# EAGLE design Canbus controller - 4 (EAGLE 9.6.0)
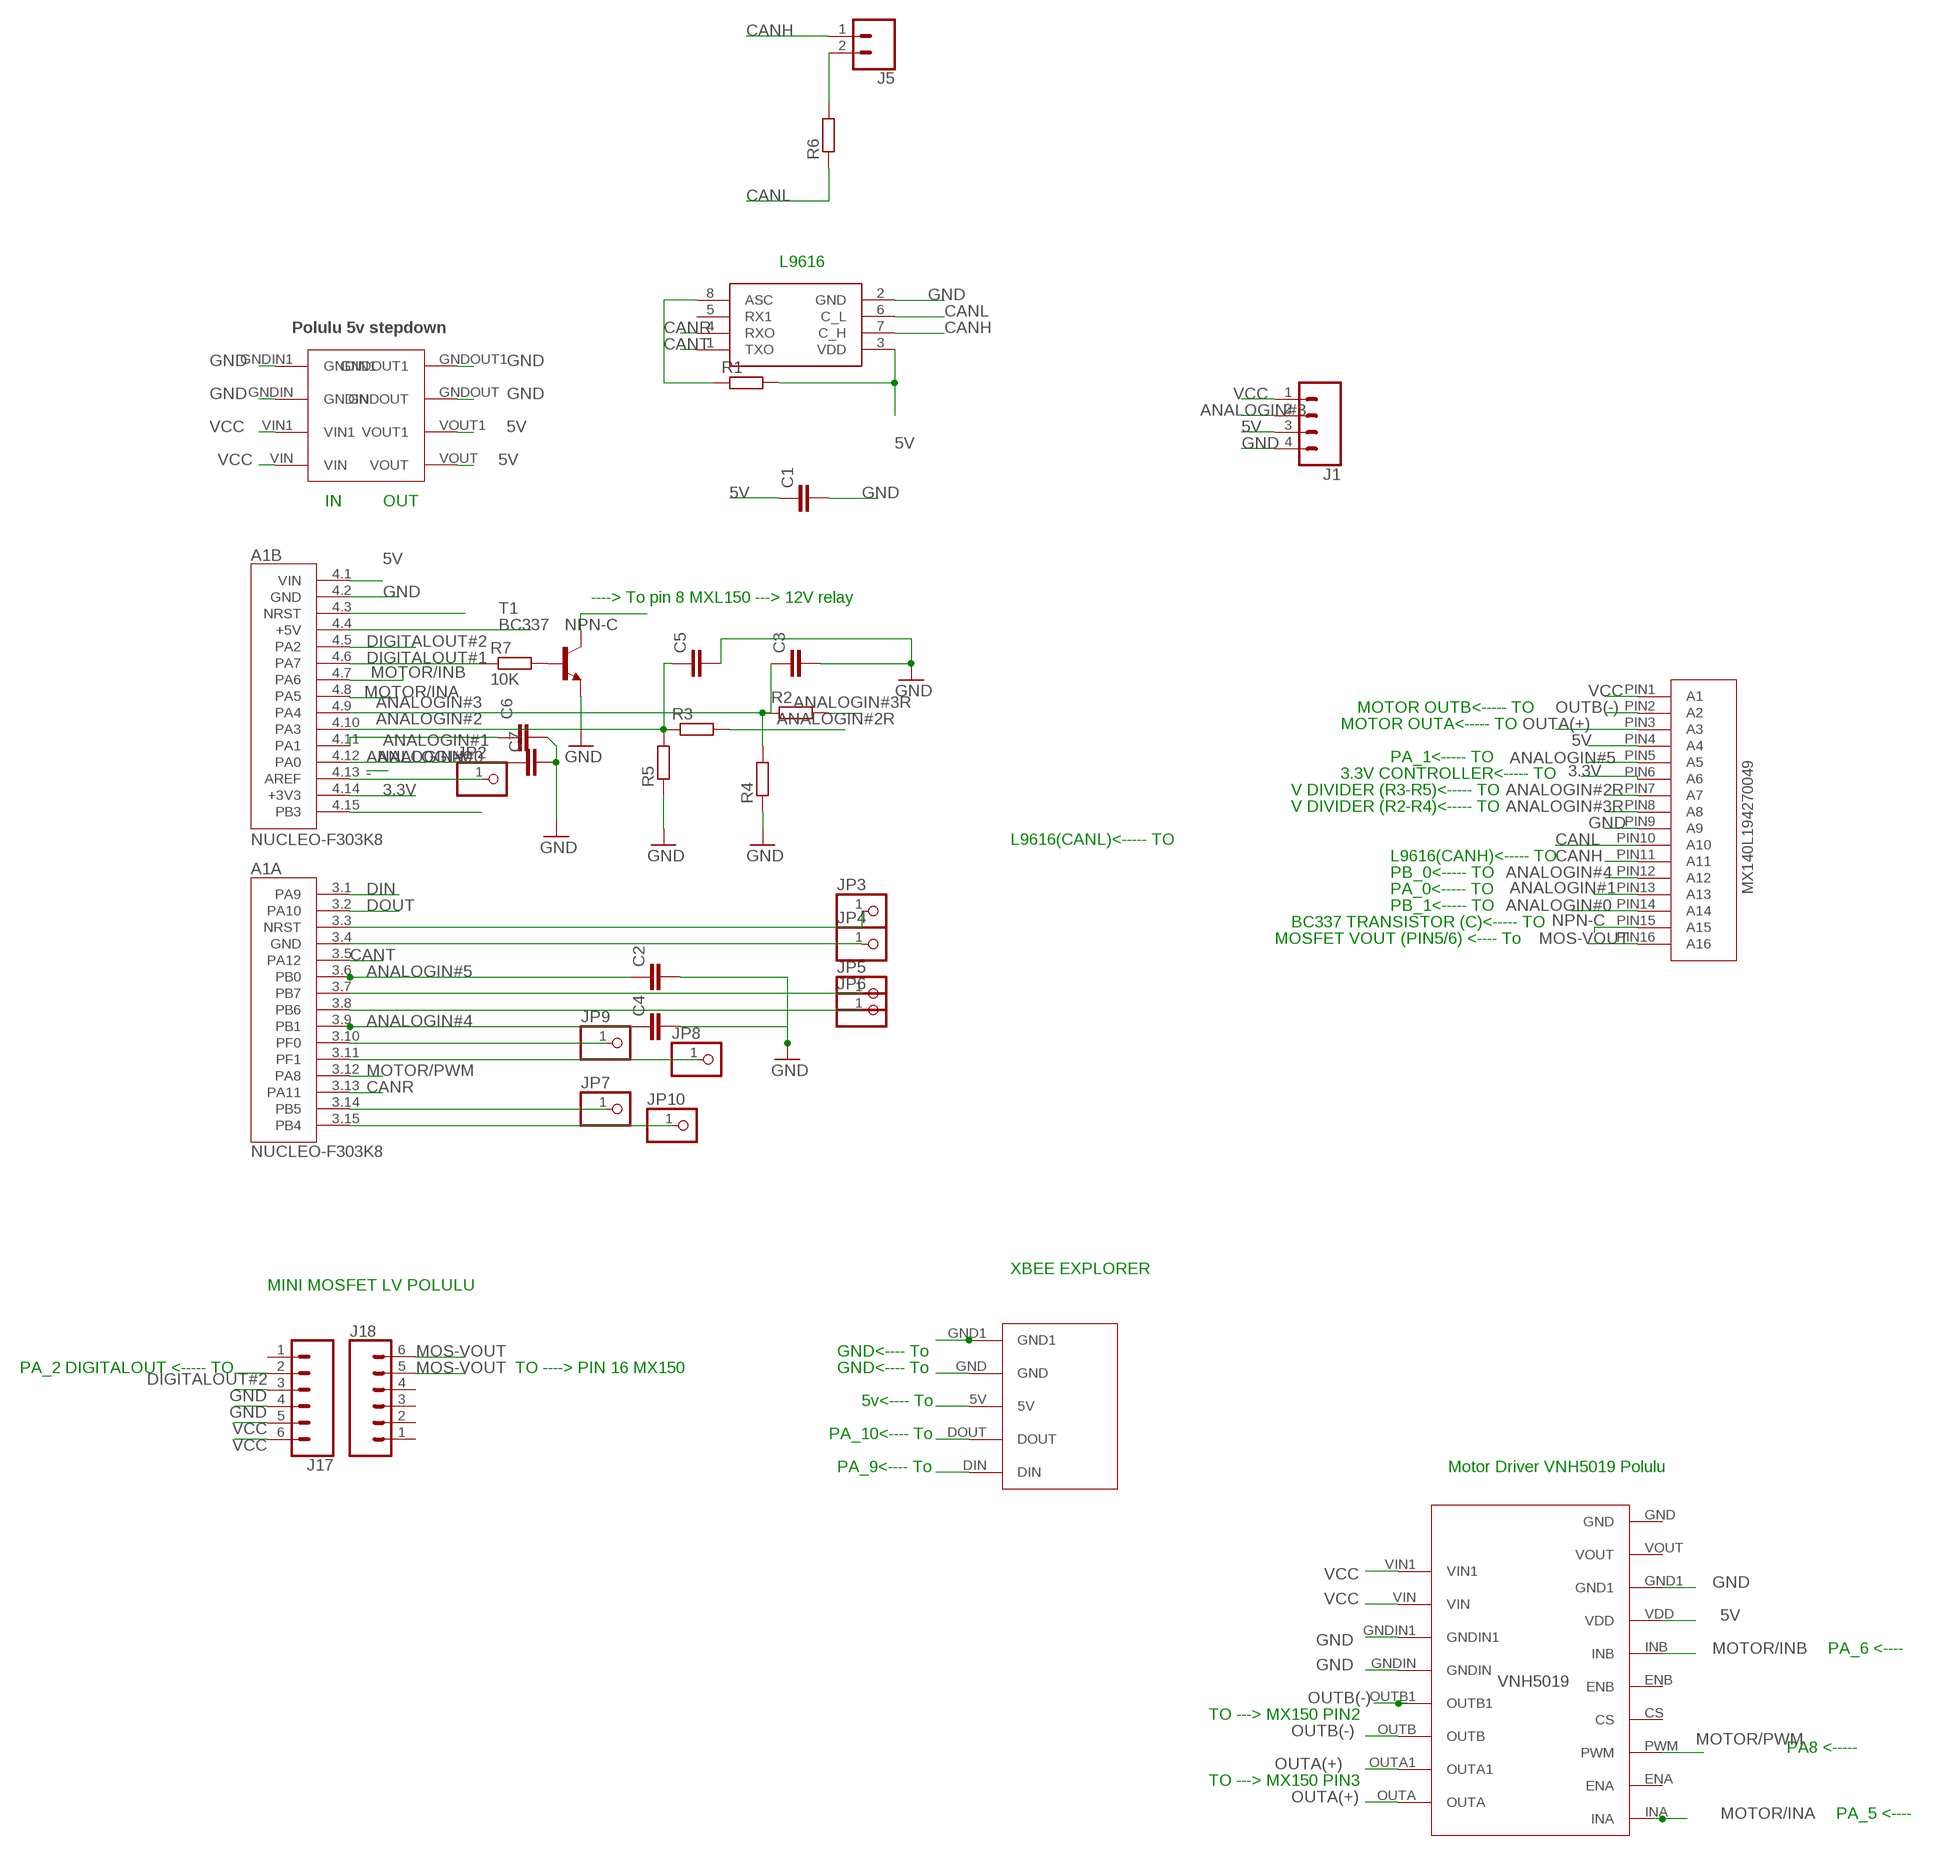
[diagram p0: schematic, sheet 1]

## Parts
A1  NUCLEO-F303K8  [MODULE_NUCLEO-F303K8]
C1  C2,5-3  [C2.5-3]
C2  C-EUC0805  [C0805]
C3  C-EUC0805  [C0805]
C4  C-EUC0805  [C0805]
C5  C-EUC0805  [C0805]
C6  C-EUC0805  [C0805]
C7  C-EUC0805  [C0805]
J1  CONN_04POLAR  [MOLEX-1X4]
J5  CONN_02  [1X02]
J17  CONN_06NO_SILK_FEMALE_PTH  [1X06_NO_SILK]
J18  CONN_06NO_SILK_FEMALE_PTH  [1X06_NO_SILK]
JP2  PINHD-1X1  [1X01]
JP3  PINHD-1X1  [1X01]
JP4  PINHD-1X1  [1X01]
JP5  PINHD-1X1  [1X01]
JP6  PINHD-1X1  [1X01]
JP7  PINHD-1X1  [1X01]
JP8  PINHD-1X1  [1X01]
JP9  PINHD-1X1  [1X01]
JP10  PINHD-1X1  [1X01]
R1  R-EU_0207/7  [0207/7]
R2  R-EU_0207/7  [0207/7]
R3  R-EU_0207/7  [0207/7]
R4  R-EU_0207/7  [0207/7]
R5  R-EU_0207/7  [0207/7]
R6  R-EU_0207/7  [0207/7]
R7  10K  R-EU_0207/7  [0207/7]
T1  BC337  [TO92]
U$1  L9616  [SO8]
U$2  MX140L-194270049  [MX150L-194270049]
U$3  XBEEEXPLORER  [XBEEREGULATED]
U$4  VNH5019  [VNH5019]
U$5  5VSTEPDOWN  [5VSTEPDOWN]

## Nets
3.3V: A1.4.14(B:+3V3) U$2.PIN6(A6)
5V: A1.4.1(B:VIN) C1.1 J1.3 R1.2 U$1.3(VDD) U$2.PIN4(A4) U$3.5V U$4.VDD U$5.VOUT U$5.VOUT1
-: A1.4.13(B:AREF) JP2.1
ANALOGIN#0: A1.4.12(B:PA0) C7.1 U$2.PIN14(A14)
ANALOGIN#1: A1.4.11(B:PA1) C6.1 U$2.PIN13(A13)
ANALOGIN#2: A1.4.10(B:PA3) C5.1 R3.1 R5.2
ANALOGIN#2R: R3.2 U$2.PIN7(A7)
ANALOGIN#3: A1.4.9(B:PA4) C3.1 J1.2 R2.1 R4.2
ANALOGIN#3R: R2.2 U$2.PIN8(A8)
ANALOGIN#4: A1.3.9(A:PB1) C4.1 U$2.PIN12(A12)
ANALOGIN#5: A1.3.6(A:PB0) C2.1 U$2.PIN5(A5)
CANH: J5.1 U$1.7(C_H) U$2.PIN11(A11)
CANL: R6.1 U$1.6(C_L) U$2.PIN10(A10)
CANR: A1.3.13(A:PA11) U$1.4(RXO)
CANT: A1.3.5(A:PA12) U$1.1(TXO)
DIGITALOUT#1: A1.4.6(B:PA7) R7.1
DIGITALOUT#2: A1.4.5(B:PA2) J17.2
DIN: A1.3.1(A:PA9) U$3.DIN
DOUT: A1.3.2(A:PA10) U$3.DOUT
GND: A1.4.2(B:GND) C1.2 C2.2 C3.2 C4.2 C5.2 C6.2 C7.2 J1.4 J17.3 J17.4 R4.1 R5.1 T1.1(E) U$1.2(GND) U$2.PIN9(A9) U$3.GND U$3.GND1 U$4.GND1 U$4.GNDIN U$4.GNDIN1 U$5.GNDIN U$5.GNDIN1 U$5.GNDOUT U$5.GNDOUT1
MOS-VOUT: J18.5 J18.6 U$2.PIN16(A16)
MOTOR/INA: A1.4.8(B:PA5) U$4.INA
MOTOR/INB: A1.4.7(B:PA6) U$4.INB
MOTOR/PWM: A1.3.12(A:PA8) U$4.PWM
N$1: A1.3.3(A:NRST) JP3.1
N$2: R7.2 T1.2(B)
N$3: J5.2 R6.2
N$4: R1.1 U$1.8(ASC)
N$6: A1.3.4(A:GND) JP4.1
N$7: A1.3.7(A:PB7) JP5.1
N$8: A1.3.8(A:PB6) JP6.1
N$9: A1.3.10(A:PF0) JP9.1
N$10: A1.3.11(A:PF1) JP8.1
N$11: A1.3.14(A:PB5) JP7.1
N$12: A1.3.15(A:PB4) JP10.1
N$13: A1.4.15(B:PB3)
N$15: A1.4.3(B:NRST)
N$16: A1.4.4(B:+5V)
NPN-C: T1.3(C) U$2.PIN15(A15)
OUTA(+): U$2.PIN3(A3) U$4.OUTA U$4.OUTA1
OUTB(-): U$2.PIN2(A2) U$4.OUTB U$4.OUTB1
VCC: J1.1 J17.5 J17.6 U$2.PIN1(A1) U$4.VIN U$4.VIN1 U$5.VIN U$5.VIN1
Unconnected: J17.1 J18.1 J18.2 J18.3 J18.4 U$1.5(RX1) U$4.CS U$4.ENA U$4.ENB U$4.GND U$4.VOUT

## Notes on the sheet
- L9616
- IN | OUT
- ----> To pin 8 MXL150 ---> 12V relay
- MOTOR OUTB<----- TO
- MOTOR OUTA<----- TO
- PA_1<----- TO
- 3.3V CONTROLLER<----- TO
- V DIVIDER (R3-R5)<----- TO
- V DIVIDER (R2-R4)<----- TO
- L9616(CANL)<----- TO
- L9616(CANH)<----- TO
- PB_0<----- TO
- PA_0<----- TO
- PB_1<----- TO
- BC337 TRANSISTOR (C)<----- TO
- MOSFET VOUT (PIN5/6) <---- To
- XBEE EXPLORER
- MINI MOSFET LV POLULU
- GND<---- To
- PA_2 DIGITALOUT <----- TO | TO ----> PIN 16 MX150 | GND<---- To
- 5v<---- To
- PA_10<---- To
- PA_9<---- To | Motor Driver VNH5019 Polulu
- PA_6 <----
- TO ---> MX150 PIN2
- PA8 <-----
- TO ---> MX150 PIN3
- PA_5 <----

## Library data of the parts
A1 = NUCLEO-F303K8:NUCLEO-F303K8: STM32 Nucleo-32 development board with STM32F303K8T6 MCU, supports Arduino connectivity; AVAILABILITY: Unavailable; DESCRIPTION: STM32F303K8, mbed-Enabled Development Nucleo-32 STM32F3 ARM® Cortex®-M4 MCU 32-Bit Embedded Evaluation Board; MF: STMicroelectronics; MP: NUCLEO-F303K8; PACKAGE: None; PRICE: None
C1 = capacitor-wima:C: CAPACITOR naming: grid - package width
C2-C7 = rcl:C-EU: CAPACITOR, European symbol
J1 = SparkFun-Connectors:CONN_04: Multi connection point. Often used as Generic Header-pin footprint for 0.1 inch spaced/style header connections On any of the 0.1 inch spaced packages, you can populate with these: Break Away Headers - Straight <https://www.sparkfun.com/products/116> (PRT-00116) Break Away Male Headers - Right Angle <https://www.sparkfun.com/products/553> (PRT-00553) Female Headers <https://www.sparkfun.com/products/115> (PRT-00115) Break Away Headers - Machine Pin <https://www.sparkfun.com/products/117> (PRT-00117) Break Away Female Headers - Swiss Machine Pin <https://www.sparkfun.com/products/743> (PRT-00743) For SCREWTERMINALS and SPRING TERMINALS visit here: Screw Terimnals on SparkFun.com <https://www.sparkfun.com/search/results?term=Screw+Terminals> (5mm/3.5mm/2.54mm spacing) This device is also useful as a general connection point to wire up your design to another part of your project. Our various solder wires solder well into these plated through hole pads. Hook-Up Wire - Assortment (Stranded, 22 AWG) <https://www.sparkfun.com/products/11375> (PRT-11375) Hook-Up Wire - Assortment (Solid Core, 22 AWG) <https://www.sparkfun.com/products/11367> (PRT-11367) View the entire wire category on our website here <https://www.sparkfun.com/categories/141> Special notes: Molex polarized connector foot print use with SKU : PRT-08231 with associated crimp pins and housings. 1MM SMD Version SKU: PRT-10208; PROD_ID: CONN-08186; SF_ID: PRT-08231
J5 = SparkFun-Connectors:CONN_02: Multi connection point. Often used as Generic Header-pin footprint for 0.1 inch spaced/style header connections On any of the 0.1 inch spaced packages, you can populate with these: Break Away Headers - Straight <https://www.sparkfun.com/products/116> (PRT-00116) Break Away Male Headers - Right Angle <https://www.sparkfun.com/products/553> (PRT-00553) Female Headers <https://www.sparkfun.com/products/115> (PRT-00115) Break Away Headers - Machine Pin <https://www.sparkfun.com/products/117> (PRT-00117) Break Away Female Headers - Swiss Machine Pin <https://www.sparkfun.com/products/743> (PRT-00743) For SCREWTERMINALS and SPRING TERMINALS visit here: Screw Terimnals on SparkFun.com <https://www.sparkfun.com/search/results?term=Screw+Terminals> (5mm/3.5mm/2.54mm spacing) This device is also useful as a general connection point to wire up your design to another part of your project. Our various solder wires solder well into these plated through hole pads. Hook-Up Wire - Assortment (Stranded, 22 AWG) <https://www.sparkfun.com/products/11375> (PRT-11375) Hook-Up Wire - Assortment (Solid Core, 22 AWG) <https://www.sparkfun.com/products/11367> (PRT-11367) View the entire wire category on our website here <https://www.sparkfun.com/categories/141> Special notes: Molex polarized connector foot print use with: PRT-08233 with associated crimp pins and housings. 2.54_SCREWTERM for use with PRT-10571. 3.5mm Screw Terminal footprints for PRT-08084 5mm Screw Terminal footprints for use with PRT-08432
J17 J18 = SparkFun-Connectors:CONN_06: Multi connection point. Often used as Generic Header-pin footprint for 0.1 inch spaced/style header connections On any of the 0.1 inch spaced packages, you can populate with these: Break Away Headers - Straight <https://www.sparkfun.com/products/116> (PRT-00116) Break Away Male Headers - Right Angle <https://www.sparkfun.com/products/553> (PRT-00553) Female Headers <https://www.sparkfun.com/products/115> (PRT-00115) Break Away Headers - Machine Pin <https://www.sparkfun.com/products/117> (PRT-00117) Break Away Female Headers - Swiss Machine Pin <https://www.sparkfun.com/products/743> (PRT-00743) Arduino Stackable Header - 6 Pin <https://www.sparkfun.com/products/9280> (PRT-09280) For SCREWTERMINALS and SPRING TERMINALS visit here: Screw Terimnals on SparkFun.com <https://www.sparkfun.com/search/results?term=Screw+Terminals> (5mm/3.5mm/2.54mm spacing) This device is also useful as a general connection point to wire up your design to another part of your project. Our various solder wires solder well into these plated through hole pads. Hook-Up Wire - Assortment (Stranded, 22 AWG) <https://www.sparkfun.com/products/11375> (PRT-11375) Hook-Up Wire - Assortment (Solid Core, 22 AWG) <https://www.sparkfun.com/products/11367> (PRT-11367) View the entire wire category on our website here <https://www.sparkfun.com/categories/141>; PROD_ID: CONN-08437
JP2-JP10 = pinhead:PINHD-1X1: PIN HEADER
R1-R7 = rcl:R-EU_: RESISTOR, European symbol; SPICEPREFIX: R
T1 = transistor:BC337: NPN TRANSISTOR
U$1 = CANBUS:L9616; AVAILABILITY: Unavailable; DESCRIPTION: IC TRANSCEIVER HALF 1/1 8SO; MF: STMicroelectronics; MP: L9616; PACKAGE: SO-8 STMicroelectronics; PRICE: None
U$2 = MXL150:MX140L-194270049: Molex MX150L - 1942700049 ---- Maximum per contact: 18A ---- Maxium Voltage:600V --- IP67 RATING --- Pitch: 5.84 mm --- Datasheet: https://www.molex.com/webdocs/datasheets/pdf/en-us/0194270049_PCB_HEADERS.pdf ---- Drawing----- https://www.molex.com/pdm_docs/sd/194270049_sd.pdf
U$3 = Polulu:XBEEEXPLORER
U$4 = Polulu:VNH5019
U$5 = Polulu:5VSTEPDOWN

## Net classes
1 vcc: width 0.305 mm

## Board
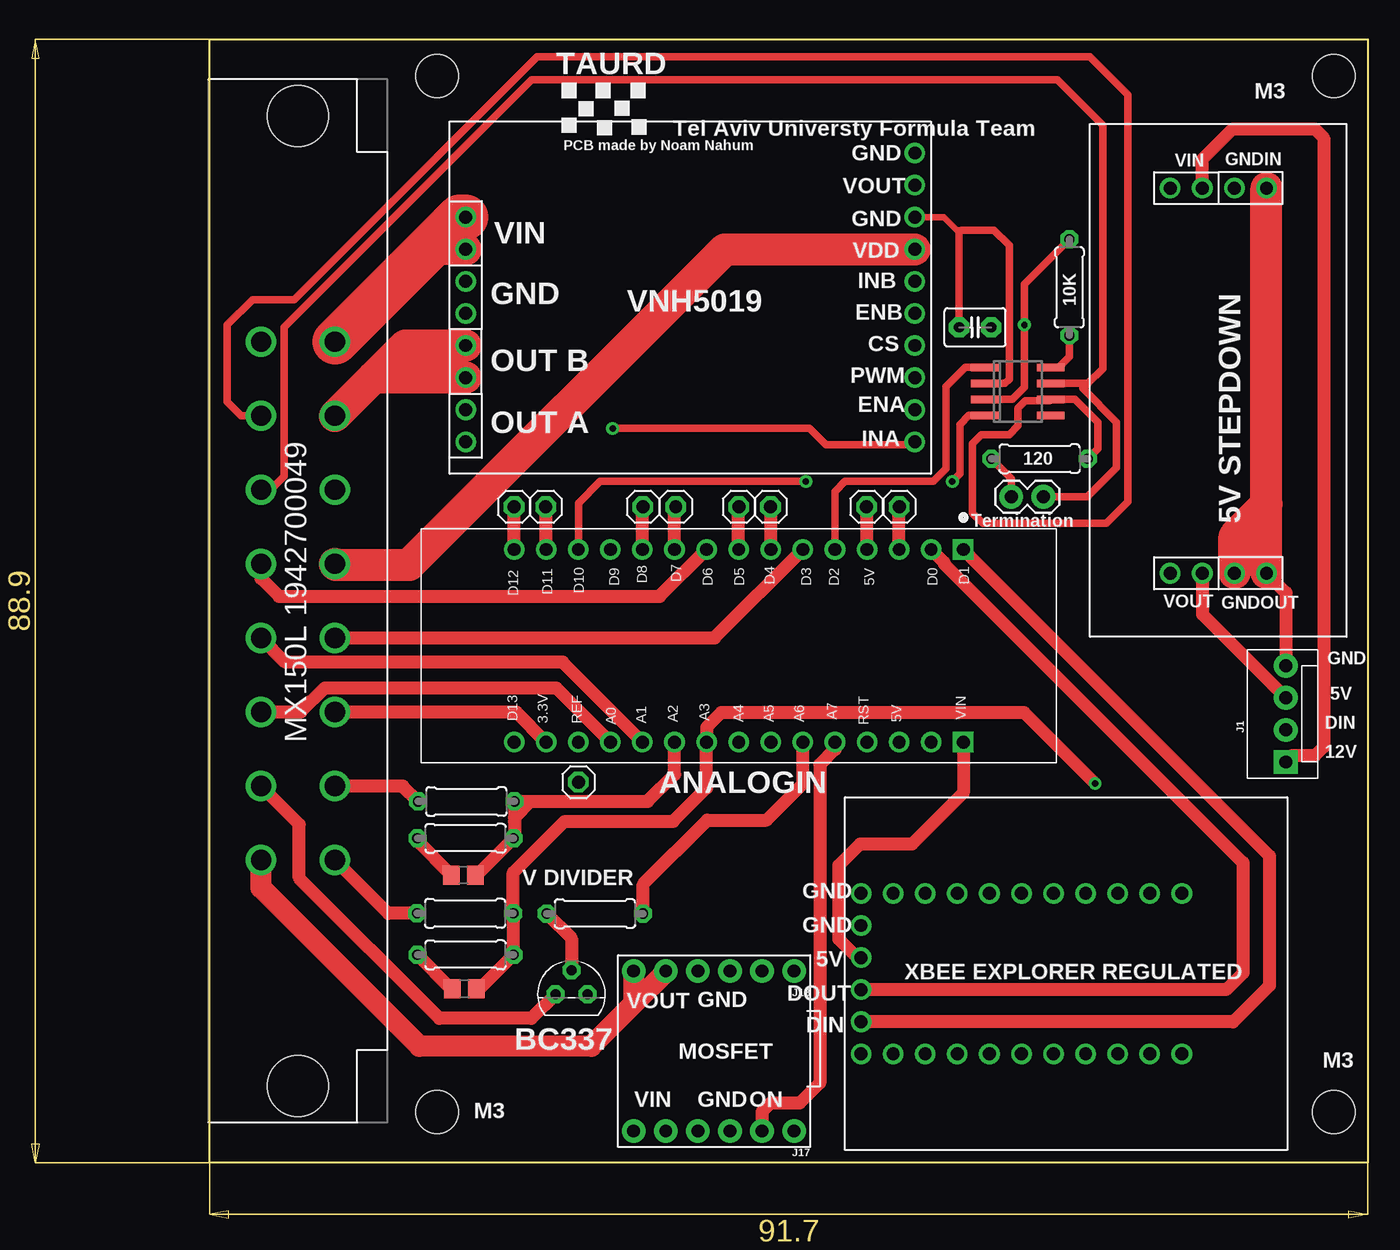
[diagram p1: board, top side]
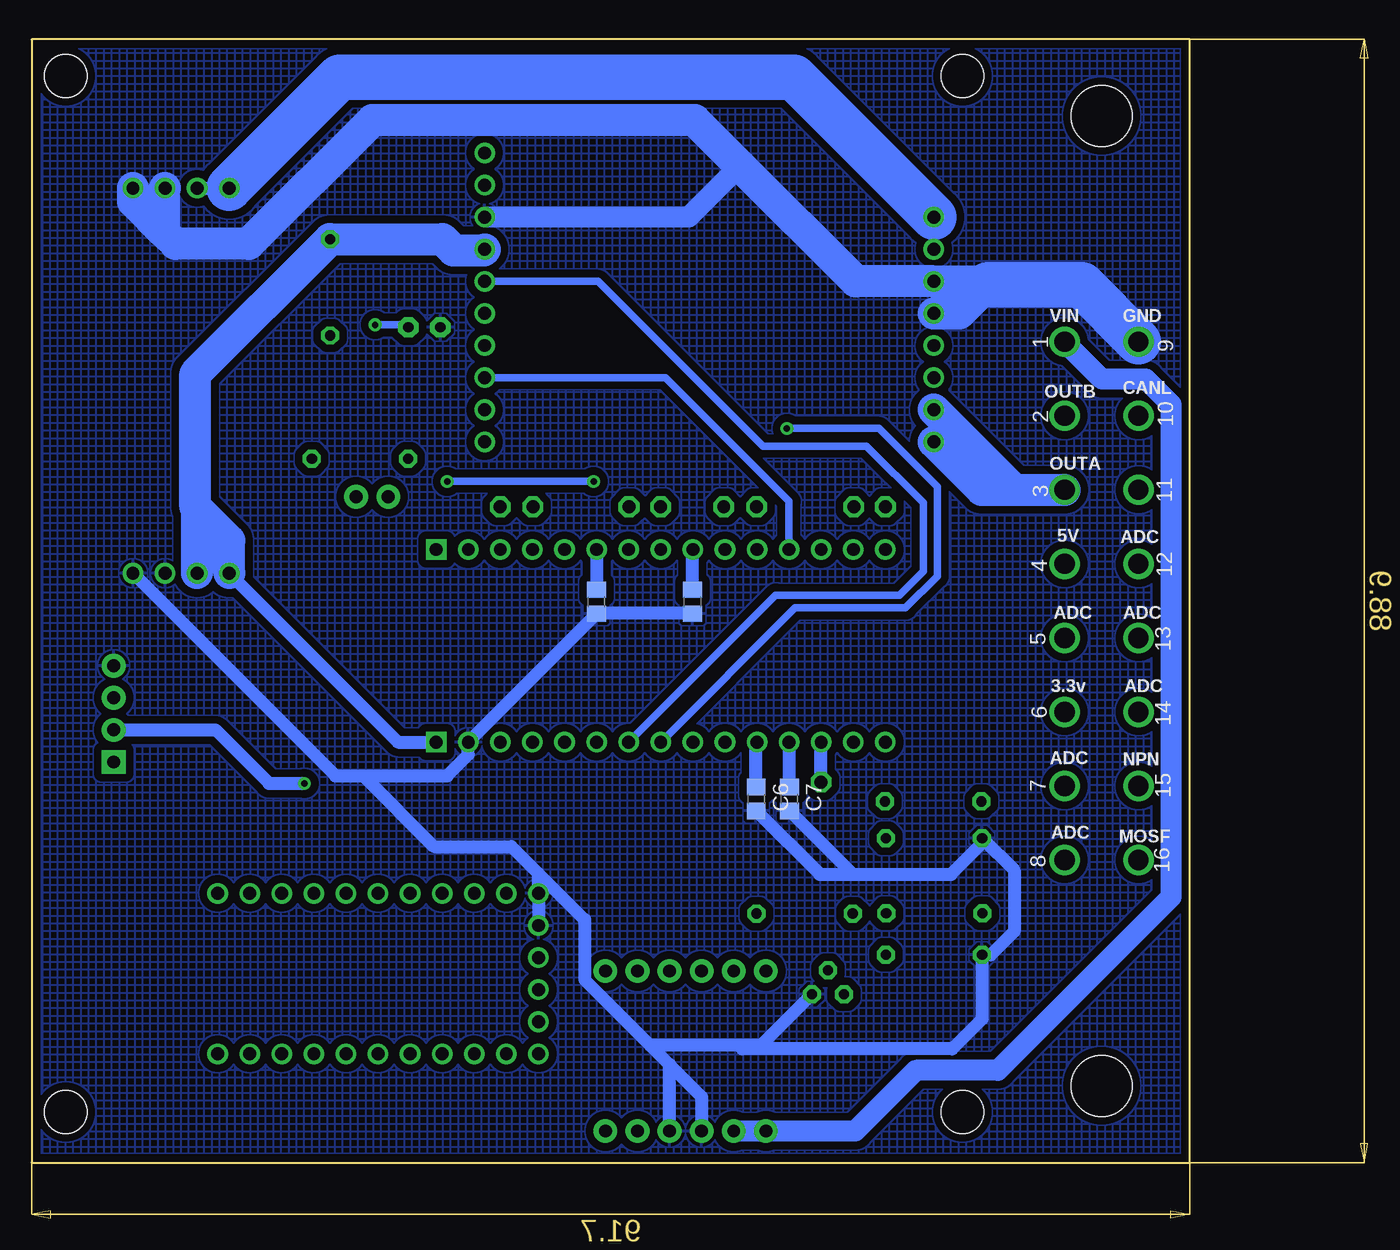
[diagram p2: board, bottom side, seen from below]

Size 91.7 x 88.9 mm. Coordinates in mm from the lower left corner, seen from the top.
Outline: 0,0 0,88.9 91.7,88.9 91.7,0 0,0
Copper layers (1*16): Top 0.035mm / dielectric 1.5mm / Bottom 0.035mm
Design rules "SparkFun": minimum track width 8mil, minimum drill 20mil, track to track 8mil, track to pad 8mil, pad to pad 8mil, via to via 8mil, smd to smd 8mil, copper to edge 8mil, drill to drill 8mil, minimum pad ring 12mil, minimum via ring 10mil, stop-mask expansion 4mil, vias tented up to drill 20mil, thermal gap 10mil
Holes 3.4 mm at 89,86 18,86 18,4 89,4

### Footprints (pad centres in the part's own frame; a part is rotated, then mirrored left to right if it is on the bottom)
MODULE_NUCLEO-F303K8 = drill 1.02 square: 3.1 -7.62,17.78; 4.1 7.62,17.78 | drill 1.02: 3.2 -7.62,15.24; 3.3 -7.62,12.7; 3.4 -7.62,10.16; 3.5 -7.62,7.62; 3.6 -7.62,5.08; 3.7 -7.62,2.54; 3.8 -7.62,0; 3.9 -7.62,-2.54; 3.10 -7.62,-5.08; 3.11 -7.62,-7.62; 3.12 -7.62,-10.16; 3.13 -7.62,-12.7; 3.14 -7.62,-15.24; 3.15 -7.62,-17.78; 4.2 7.62,15.24; 4.3 7.62,12.7; 4.4 7.62,10.16; 4.5 7.62,7.62; 4.6 7.62,5.08; 4.7 7.62,2.54; 4.8 7.62,0; 4.9 7.62,-2.54; 4.10 7.62,-5.08; 4.11 7.62,-7.62; 4.12 7.62,-10.16; 4.13 7.62,-12.7; 4.14 7.62,-15.24; 4.15 7.62,-17.78
C2.5-3 = drill 0.813 pad 1.6 octagon: 1 -1.27,0; 2 1.27,0
C0805 = smd 1.3 x 1.5: 1 -0.95,0; 2 0.95,0
MOLEX-1X4 = drill 1.016 pad 1.88 square: 1 0,0 | drill 1.016 pad 1.88: 2 2.54,0; 3 5.08,0; 4 7.62,0
1X02 = drill 1.016 pad 1.88: 1 0,0; 2 2.54,0
1X06_NO_SILK = drill 1.016 pad 1.88: 1 0,0; 2 2.54,0; 3 5.08,0; 4 7.62,0; 5 10.16,0; 6 12.7,0
1X01 = drill 1.016 octagon: 1 0,0
0207/7 = drill 0.813 octagon: 1 -3.81,0; 2 3.81,0
TO92 = drill 0.813 octagon: 1 1.27,0; 2 0,1.905; 3 -1.27,0
SO8 = smd 0.6 x 2.2: 1 -1.905,-2.6; 2 -0.635,-2.6; 3 0.635,-2.6; 4 1.905,-2.6; 5 1.905,2.6; 6 0.635,2.6; 7 -0.635,2.6; 8 -1.905,2.6
MX150L-194270049 = drill 1.6: PIN1 20.51,-2.93; PIN2 14.65,-2.93; PIN3 8.79,-2.93; PIN4 2.93,-2.93; PIN5 -2.93,-2.93; PIN6 -8.79,-2.93; PIN7 -14.65,-2.93; PIN8 -20.51,-2.93; PIN9 20.51,2.92; PIN10 14.65,2.92; PIN11 8.79,2.92; PIN12 2.93,2.92; PIN13 -2.93,2.92; PIN14 -8.79,2.92; PIN15 -14.65,2.92; PIN16 -20.51,2.92 | hole 4.86: -38.38,0; 38.38,0
XBEEREGULATED = drill 1.02: 5V 1.27,20.32; DIN 1.27,15.24; DOUT 1.27,17.78; GND 1.27,22.86; GND1 1.27,25.4; P$1 1.27,12.7; P$7 3.81,25.4; P$8 6.35,25.4; P$9 8.89,25.4; P$10 11.43,25.4; P$11 13.97,25.4; P$12 16.51,25.4; P$13 19.05,25.4; P$14 21.59,25.4; P$15 24.13,25.4; P$16 26.67,25.4; P$17 3.81,12.7; P$18 6.35,12.7; P$19 8.89,12.7; P$20 11.43,12.7; P$21 13.97,12.7; P$22 16.51,12.7; P$23 19.05,12.7; P$24 21.59,12.7; P$25 24.13,12.7; P$26 26.67,12.7
VNH5019 = drill 1.02: CS 36.83,10.16; ENA 36.83,5.08; ENB 36.83,12.7; GND 36.83,25.4; GND1 36.83,20.32; GNDIN 1.27,12.7; GNDIN1 1.27,15.24; INA 36.83,2.54; INB 36.83,15.24; OUTA 1.27,2.54; OUTA1 1.27,5.08; OUTB 1.27,7.62; OUTB1 1.27,10.16; PWM 36.83,7.62; VDD 36.83,17.78; VIN 1.27,17.78; VIN1 1.27,20.32; VOUT 36.83,22.86
5VSTEPDOWN = drill 1.02: GNDIN 5.08,11.43; GNDIN1 5.08,13.97; GNDOUT 35.56,11.43; GNDOUT1 35.56,13.97; VIN 5.08,6.35; VIN1 5.08,8.89; VOUT 35.56,6.35; VOUT1 35.56,8.89

### Placement (x,y rotation side)
A1  41.88,40.89 270 top
C1  60.6,66.1 180 top
C2  46.98,44.38 270 bottom
C3  20.18,13.76 180 top
C4  39.37,44.38 270 bottom
C5  20.08,22.75 180 top
C6  34.33,28.78 270 bottom
C7  31.71,28.78 270 bottom
J1  85.2,31.7 90 top
J5  66,52.7 180 top
J17  46.27,2.5 180 top
J18  46.27,15.15 180 top
JP2  29.2,30.1 0 top
JP3  54.6,51.9 0 top
JP4  52,51.9 0 top
JP5  44.4,51.9 0 top
JP6  41.9,51.9 0 top
JP7  26.6,51.9 0 top
JP8  34.3,51.9 0 top
JP9  36.9,51.9 0 top
JP10  24.1,51.9 0 top
R1  68.06,69.27 90 top
R2  20.23,19.72 180 top
R3  20.32,28.57 180 top
R4  20.25,16.44 0 top
R5  20.25,25.66 0 top
R6  65.7,55.7 180 top
R7  30.5,19.7 180 top
T1  28.65,13.32 0 top
U$1  63.98,61.03 270 top
U$2  6.99,44.45 90 top
U$3  50.3,-4.1 0 top
U$4  19,54.5 0 top
U$5  69.7,82.2 270 top

### Tracks (layer width: path | path; a pad name or v marks a point on that pad's centre or on a via)
3.3V
  Top 1.016: U$2.PIN6 24.26,35.66 A1.4.14
5V  (via drill 0.51)
  Top 0.61: U$1.3 63.55,60.4 64.5,61.35 v64.5,66.3 64.5,69.51 R1.2
  Top 1.016: A1.4.1 59.66,29.27 55.6,25.2 51.5,25.2 49.8,23.5 49.8,17.7 51.28,16.22 U$3.5V | U$5.VOUT1 78.59,43.39 J1.3
  Top 2.54: U$2.PIN4 9.99,47.3 15.8,47.3 40.78,72.28 U$4.VDD
  Bottom 0.61: v64.5,66.3 62.07,66.3 C1.1
  Bottom 1.016: U$5.VOUT 62.68,33.27 A1.4.1
  Bottom 2.54: U$4.VDD 55.91,72.2 58.3,72.2 59.17,73.08 R1.2 78.73,62.41 78.73,51.9 78.59,51.76 | U$5.VOUT 76.05,49.22 78.59,51.76 | U$5.VOUT1 78.59,51.76
-
  Bottom 1.016: JP2.1 29.2,33.26 A1.4.13
ANALOGIN#0
  Top 1.016: U$2.PIN14 7.21,35.66 9.12,37.57 27.43,37.57 A1.4.12
  Bottom 1.016: C7.1 A1.4.12
ANALOGIN#1
  Top 1.016: U$2.PIN13 5.99,39.6 27.94,39.6 A1.4.11
  Bottom 1.016: C6.1 34.33,33.21 A1.4.11
ANALOGIN#2
  Top 1.016: 24.13,27.3 R3.1 25.4,28.57 | C5.1 21.15,22.75 R5.2 24.13,25.73 24.13,27 24.13,27.3 | A1.4.10 36.8,30.7 34.67,28.57 25.4,28.57 | 25.4,28.57 24.13,27.3
ANALOGIN#2R
  Top 1.016: R3.2 15.29,29.8 U$2.PIN7
ANALOGIN#3  (via drill 0.51)
  Top 1.016: C3.1 21.39,13.76 R4.2 24.07,19.7 R2.1 24.04,22.94 28.1,27 36.7,27 39.34,29.64 A1.4.9 39.34,34.45 40.5,35.6 64.5,35.6 v70.1,30
  Bottom 1.016: J1.2 77.14,34.24 72.9,30 v70.1,30
ANALOGIN#3R
  Top 1.016: R2.2 14.13,19.72 U$2.PIN8
ANALOGIN#4
  Top 1.016: U$2.PIN12 4.07,46.23 5.5,44.8 35.63,44.8 A1.3.9
  Bottom 1.016: C4.1 39.37,48.49 A1.3.9
ANALOGIN#5
  Top 1.016: A1.3.6 39.97,41.52 U$2.PIN5
  Bottom 1.016: A1.3.6 46.97,45.34 C2.1
CANH
  Top 0.61: U$1.7 69.53,61.66 | J5.1 69.5,52.7 71.8,55 71.8,58.6 69.14,61.27 69.53,61.66 | 69.53,61.66 70.7,62.83 70.7,82.1 67.1,85.7 25.5,85.7 5.9,66.1 5.9,54.3 4.84,53.24 U$2.PIN11
CANL
  Top 0.61: R6.1 70.3,56.49 70.3,58.6 68.5,60.4 U$1.6 66.48,60.3 64.6,60.3 64,59.7 64,58.3 63.3,57.6 61.1,57.6 60.4,56.9 60.4,51.4 61.2,50.6 71,50.6 72.7,52.3 72.7,84.5 69.7,87.5 25.9,87.5 6.7,68.3 3.4,68.3 1.4,66.3 1.4,60.2 2.5,59.1 U$2.PIN10
CANR  (via drill 0.51)
  Top 0.61: A1.3.13 29.18,52.19 30.9,53.9 v47.2,53.9 | v58.8,53.9 59.4,54.5 59.4,58.4 60.12,59.12 U$1.4
  Bottom 0.61: v47.2,53.9 v58.8,53.9
CANT
  Top 0.61: A1.3.5 49.51,53.1 50.3,53.9 57.3,53.9 58.3,54.9 58.3,61.4 59.84,62.94 U$1.1
DIGITALOUT#1
  Top 1.016: R7.1 34.31,22.01 39.4,27.1 44.1,27.1 46.97,29.96 A1.4.6
DIGITALOUT#2
  Top 1.016: A1.4.5 49.51,32.7 48.3,31.5 48.3,6.3 46.7,4.7 44.4,4.7 43.73,4.03 J17.2
DIN
  Top 1.016: A1.3.1 83.9,24.28 83.9,14 81.04,11.14 U$3.DIN
DOUT
  Top 1.016: A1.3.2 58.14,47.5 58.14,47.41 81.8,23.74 81.8,15 80.48,13.68 U$3.DOUT
GND
  Top 0.508: U$4.GND1 58.12,74.82 59.15,73.79 | 59.15,73.79 59.33,73.61 | 59.51,73.79 59.15,73.79
  Top 0.61: U$1.2 62.97,61.66 63.3,62 63.3,72.58 62.09,73.79 59.51,73.79 | C1.2 59.33,73.61
  Top 1.016: C5.2 16.45,25.43 R5.1 | R4.1 19.12,13.76 C3.2 | U$5.GNDOUT1 85.2,45.11 J1.4
  Top 2.54: U$5.GNDOUT1 83.67,52.1 | 83.67,52.1 U$5.GNDIN1 | U$5.GNDOUT 81.13,49.56 83.67,52.1
  Bottom 1.016: 65.43,30.6 58.8,30.6 57.12,32.27 A1.4.2 46.98,43.42 C2.2 46.88,43.53 39.47,43.53 C4.2 | 65.43,30.6 59.83,25 53.7,25 51.57,22.87 | J17.3 41.19,7.74 | 42.73,9.28 47.92,14.47 47.92,19.22 51.57,22.87 | 42.73,9.28 41.19,7.74 | 41.19,7.74 38.65,5.2 J17.4 | T1.1 33.96,9.28 35.7,9.28 | 35.7,9.28 42.73,9.28 | 35.7,9.28 35.42,9 18.8,9 16.45,11.36 R4.1 15.76,16.44 13.9,18.3 13.9,23.12 R5.1 16.45,25.25 18.9,22.8 26.68,22.8 | C7.2 26.68,22.8 | C6.2 29.3,22.8 26.68,22.8 | U$5.GNDOUT1 67.63,30.6 65.43,30.6 | 51.57,22.87 U$3.GND1 U$3.GND
  Bottom 1.676: 35.6,78.9 39.68,74.82 U$4.GND1
  Bottom 2.54: U$4.GNDIN 18.26,67.2 16,69.46 16.28,69.74 U$4.GNDIN1 26.44,69.74 35.6,78.9 39.2,82.5 64.7,82.5 74.5,72.7 80.3,72.7 81.2,73.6 | 81.2,73.6 81.2,77.05 U$5.GNDIN | 81.2,73.6 83.67,76.07 U$5.GNDIN1
  Bottom 3.607: 16,69.46 8.56,69.46 U$2.PIN9
  pour Bottom (isolate 0.61, hatched): 0,0.1 -0.4,88.9 91.9,88.9 91.9,0 0,0
MOS-VOUT
  Top 1.676: J18.6 33.57,12.57 | 33.57,12.57 30.2,9.2 16.61,9.2 4.07,21.74 U$2.PIN16 | J18.5 36.11,15.11 33.57,12.57
MOTOR/INA  (via drill 0.51)
  Top 0.61: v31.9,58.1 47.5,58.1 48.8,56.8 55.59,56.8 U$4.INA
  Bottom 0.61: A1.4.8 31.26,43.9 22.5,43.9 20,46.4 20,53.5 24.6,58.1 v31.9,58.1
MOTOR/INB
  Bottom 0.61: A1.4.7 32.8,44.9 23,44.9 21.1,46.8 21.1,52.2 25.6,56.7 33.8,56.7 46.84,69.74 U$4.INB
MOTOR/PWM
  Bottom 0.61: A1.3.12 31.73,52.33 41.52,62.12 U$4.PWM
N$1
  Top 1.016: A1.3.3 54.59,51.88 JP3.1
N$2
  Top 1.016: R7.2 28.65,17.74 T1.2
N$3
  Top 0.61: R6.2 63.46,54.13 J5.2
N$4
  Top 0.61: R1.1 68.06,63.77 67.23,62.94 U$1.8
N$6
  Top 1.016: A1.3.4 52.05,51.85 JP4.1
N$7
  Top 1.016: A1.3.7 44.42,51.88 JP5.1
N$8
  Top 1.016: A1.3.8 41.88,51.88 JP6.1
N$9
  Top 1.016: A1.3.10 36.8,51.8 JP9.1
N$10
  Top 1.016: A1.3.11 34.27,51.87 JP8.1
N$11
  Top 1.016: A1.3.14 26.64,51.85 JP7.1
N$12
  Top 1.016: A1.3.15 JP10.1
NPN-C
  Top 1.016: T1.3 25.46,11.4 18.2,11.4 7.1,22.5 7.1,26.77 U$2.PIN15
OUTA(+)
  Bottom 2.54: U$4.OUTA1 13.93,53.24 U$2.PIN3 16.47,53.24 U$4.OUTA
OUTB(-)
  Top 2.54: U$4.OUTB1 15.47,64.66 U$2.PIN2 12.94,62.12 U$4.OUTB
VCC
  Top 1.016: U$5.VIN1 78.59,79.39 81,81.8 87.5,81.8 88.2,81.1 88.2,32.9 87.5,32.2 85.7,32.2 J1.1
  Top 2.54: U$4.VIN 17.23,72.28 16.98,72.02
  Top 3.607: U$2.PIN1 16.98,72.02 19.77,74.82 U$4.VIN1
  Bottom 1.016: U$5.VIN1 U$5.VIN
  Bottom 1.676: J17.5 J17.6 26.5,2.5 21.7,7.3 15.2,7.3 1.5,21 1.5,60 3.5,62 6.96,62 U$2.PIN1
  Bottom 3.607: U$4.VIN1 31.35,85.9 67.3,85.9 76.05,77.15 U$5.VIN

### Text on the board
tPlace: TAURD | M3 | Tel Aviv Universty Formula Team | PCB made by Noam Nahum | 10K | VNH5019 | 120 | Termination | D9 | D8 | D7 | D6 | D5 | D4 | D3 | D2 | 5V | D0 | D1 | D12 | D11 | D10 | GND | 5V | D13 | 3.3V | REF | A0 | A1 | A2 | A3 | A4 | A5 | A6 | A7 | RST | 5V | VIN | DIN | 12V | ANALOGIN | V DIVIDER | VOUT | GND | BC337 | MOSFET | M3 | M3 | VIN | GND | ON
bPlace: GND | VIN | CANL | OUTB | OUTA | ADC | 5V | ADC | ADC | ADC | 3.3v | ADC | NPN | ADC | MOSF
Holes: M3